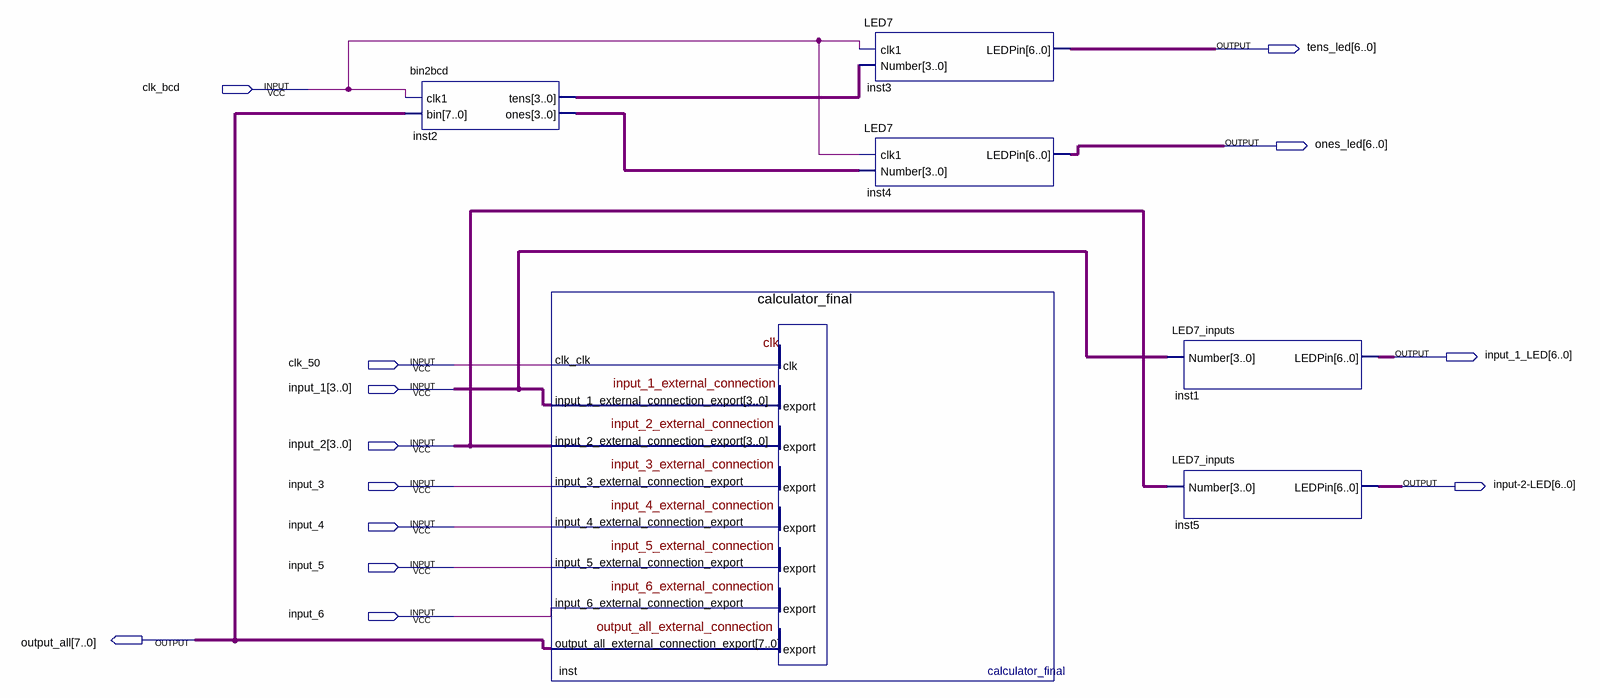
[diagram p0: schematic sheet]
// Quartus schematic top.bdf as structural Verilog: 6 symbols, 13 pins
module top (
  input  clk_bcd,
  input  clk_50,
  input  [3:0] input_1,
  input  [3:0] input_2,
  input  input_3,
  input  input_4,
  input  input_5,
  input  input_6,
  output [6:0] tens_led,
  output [6:0] ones_led,
  output [6:0] input_1_LED,
  output [6:0] \input-2-LED ,
  output [7:0] output_all
);

  wire [3:0] inst2_ones, inst2_tens;

  bin2bcd inst2 (.clk1(clk_bcd), .bin(output_all), .tens(inst2_tens), .ones(inst2_ones));
  calculator_final inst (
    .clk_clk(clk_50), .input_1_external_connection_export(input_1),
    .input_2_external_connection_export(input_2), .input_3_external_connection_export(input_3),
    .input_4_external_connection_export(input_4), .input_5_external_connection_export(input_5),
    .input_6_external_connection_export(input_6), .output_all_external_connection_export(output_all));
  LED7 inst3 (.clk1(clk_bcd), .Number(inst2_tens), .LEDPin(tens_led));
  LED7 inst4 (.clk1(clk_bcd), .Number(inst2_ones), .LEDPin(ones_led));
  LED7_inputs inst1 (.Number(input_1), .LEDPin(input_1_LED));
  LED7_inputs inst5 (.Number(input_2), .LEDPin(\input-2-LED ));
endmodule
